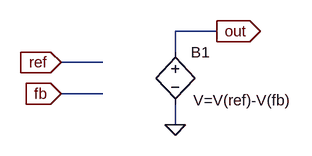
[diagram p0: schematic sub.asc]
sub.asc, the LTspice schematic file:
Version 4
SHEET 1 880 680
WIRE 176 64 112 64
WIRE 112 96 112 64
WIRE 0 112 -64 112
WIRE 0 160 -64 160
WIRE 112 208 112 176
FLAG -64 112 ref
IOPIN -64 112 In
FLAG -64 160 fb
IOPIN -64 160 In
FLAG 176 64 out
IOPIN 176 64 Out
FLAG 112 208 0
SYMBOL bv 112 80 R0
WINDOW 3 28 90 Left 0
SYMATTR Value V=V(ref)-V(fb)
SYMATTR InstName B1

The netlist it stands for:
* sub.asc
B1 out 0 V=V(ref)-V(fb)
.backanno
.end